# EAGLE schematic sensor_board2 (EAGLE 9.7.0)
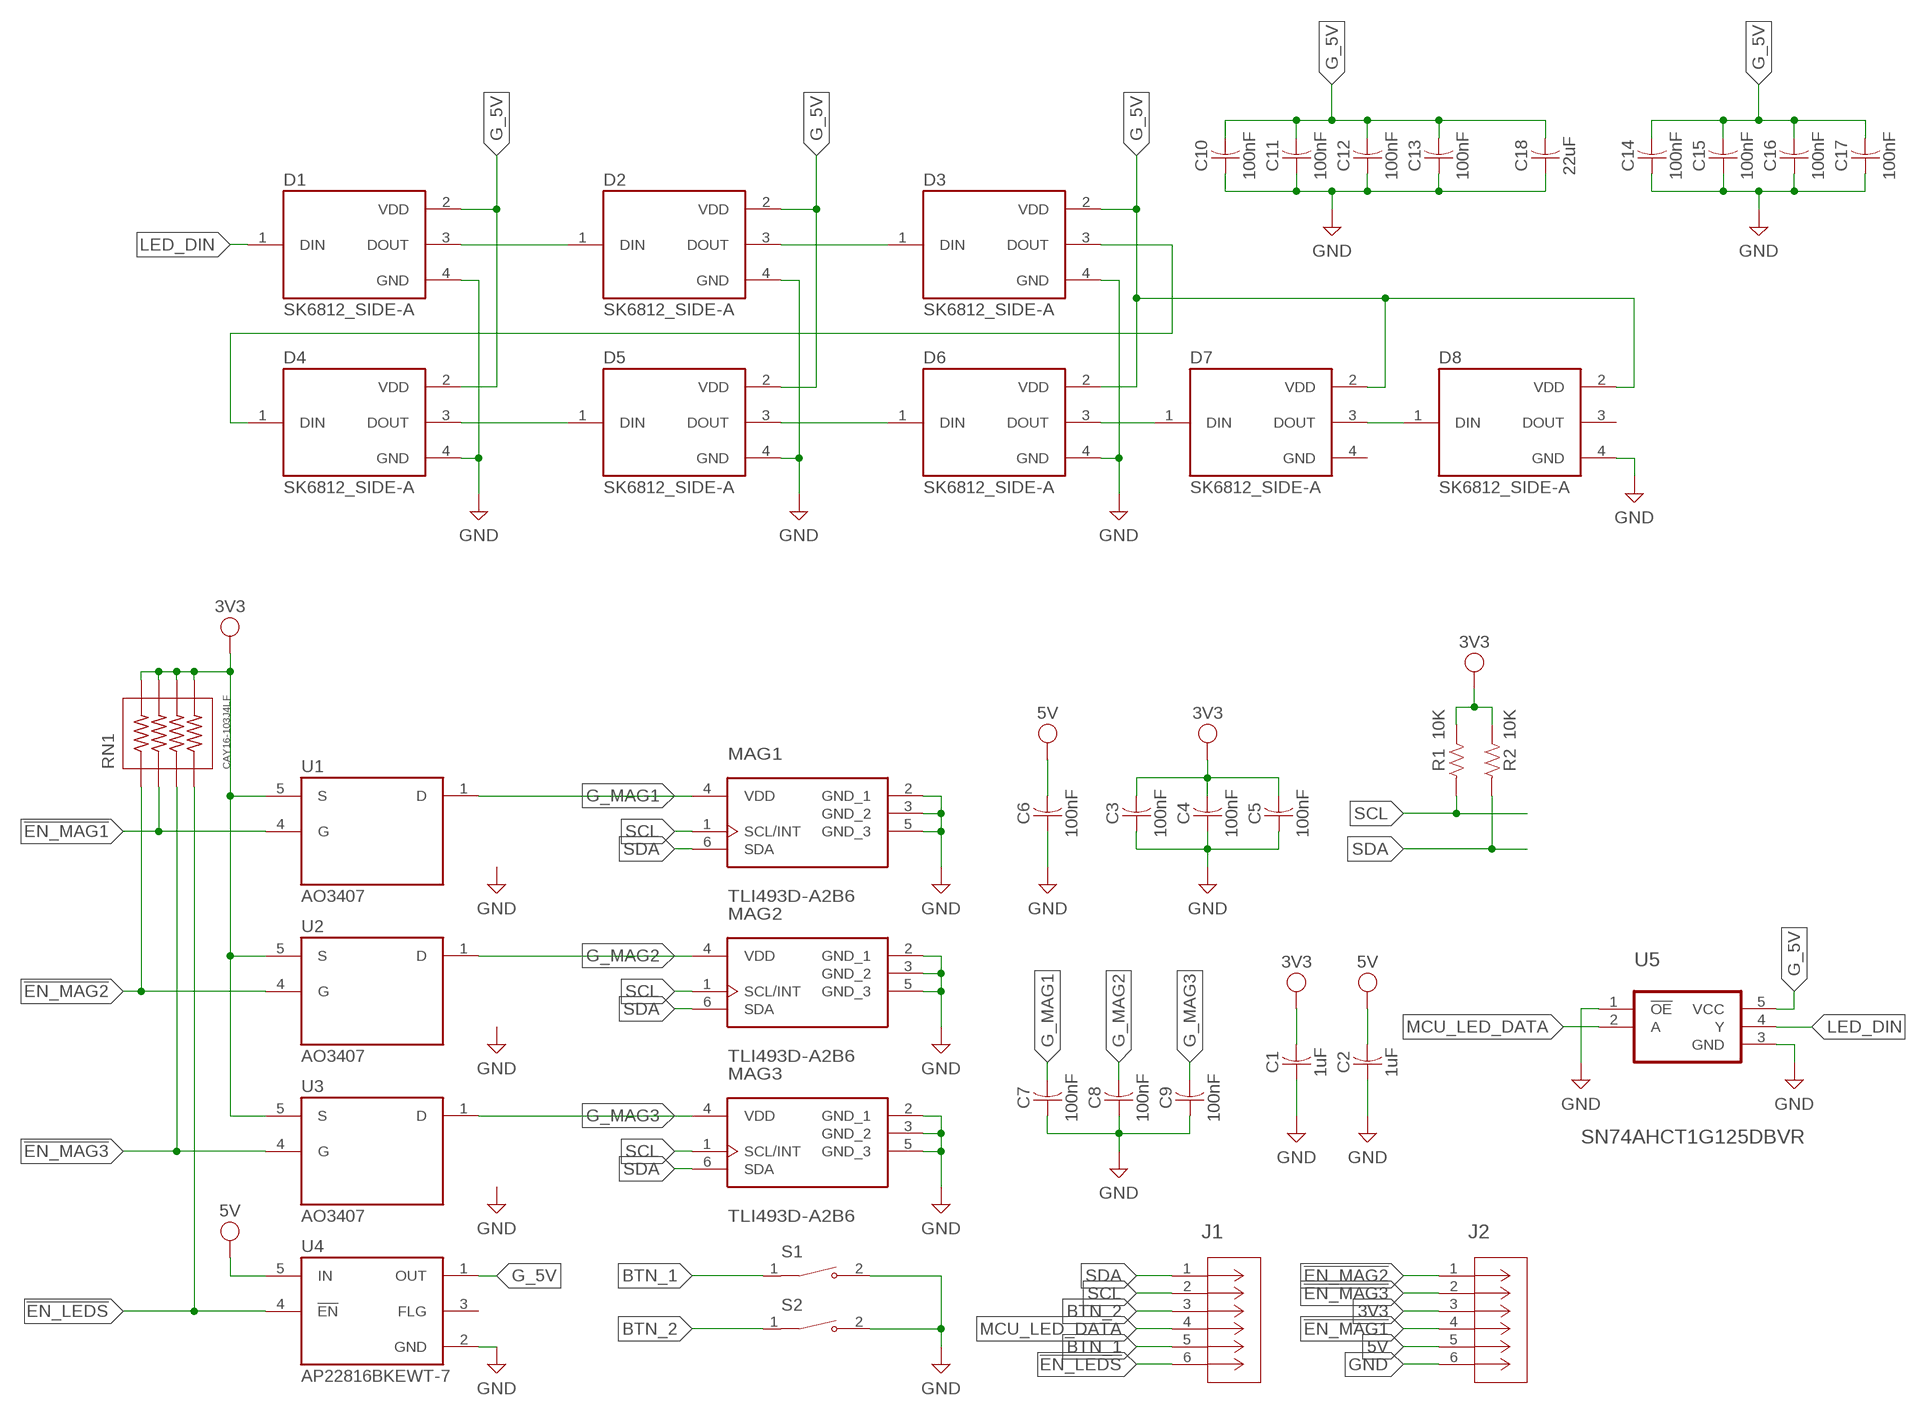
[diagram p0: schematic, sheet 1]

## Parts
C1  1uF  C-US_CHIP-1206(3216-METRIC)  [CAPC3216X135]
C2  1uF  C-US_CHIP-1206(3216-METRIC)  [CAPC3216X135]
C3  100nF  C-US_CHIP-0805(2012-METRIC)  [CAPC2012X110]
C4  100nF  C-US_CHIP-0805(2012-METRIC)  [CAPC2012X110]
C5  100nF  C-US_CHIP-0805(2012-METRIC)  [CAPC2012X110]
C6  100nF  C-US_CHIP-0805(2012-METRIC)  [CAPC2012X110]
C7  100nF  C-US_CHIP-0805(2012-METRIC)  [CAPC2012X110]
C8  100nF  C-US_CHIP-0805(2012-METRIC)  [CAPC2012X110]
C9  100nF  C-US_CHIP-0805(2012-METRIC)  [CAPC2012X110]
C10  100nF  C-US_CHIP-0805(2012-METRIC)  [CAPC2012X110]
C11  100nF  C-US_CHIP-0805(2012-METRIC)  [CAPC2012X110]
C12  100nF  C-US_CHIP-0805(2012-METRIC)  [CAPC2012X110]
C13  100nF  C-US_CHIP-0805(2012-METRIC)  [CAPC2012X110]
C14  100nF  C-US_CHIP-0805(2012-METRIC)  [CAPC2012X110]
C15  100nF  C-US_CHIP-0805(2012-METRIC)  [CAPC2012X110]
C16  100nF  C-US_CHIP-0805(2012-METRIC)  [CAPC2012X110]
C17  100nF  C-US_CHIP-0805(2012-METRIC)  [CAPC2012X110]
C18  22uF  C-US_CHIP-1206(3216-METRIC)  [CAPC3216X135]
D1  SK6812_SIDE-A  [LED_SK6812_SIDE-A]
D2  SK6812_SIDE-A  [LED_SK6812_SIDE-A]
D3  SK6812_SIDE-A  [LED_SK6812_SIDE-A]
D4  SK6812_SIDE-A  [LED_SK6812_SIDE-A]
D5  SK6812_SIDE-A  [LED_SK6812_SIDE-A]
D6  SK6812_SIDE-A  [LED_SK6812_SIDE-A]
D7  SK6812_SIDE-A  [LED_SK6812_SIDE-A]
D8  SK6812_SIDE-A  [LED_SK6812_SIDE-A]
J1  NPPN032AFCN-RCCONN3X2_NPPN032AFCN-RC_SUL  [CONN3X2_NPPN032AFCN-RC_SUL]
J2  NPPN032AFCN-RCCONN3X2_NPPN032AFCN-RC_SUL  [CONN3X2_NPPN032AFCN-RC_SUL]
MAG1  TLI493D-A2B6  [SOP95P280X110-6N-V]
MAG2  TLI493D-A2B6  [SOP95P280X110-6N-V]
MAG3  TLI493D-A2B6  [SOP95P280X110-6N-V]
R1  10K  R-US_CHIP-0805(2012-METRIC)  [RESC2012X65]
R2  10K  R-US_CHIP-0805(2012-METRIC)  [RESC2012X65]
RN1  CAY16-103J4LF  [RESCAF80P320X160X60-8N]
S1  TS32-7-35-BK-160-RA-SMT-TR  [SW_TS32-7-35-BK-160-RA-SMT-TR]
S2  TS32-7-35-BK-160-RA-SMT-TR  [SW_TS32-7-35-BK-160-RA-SMT-TR]
U1  AO3407  [SOT95P280X100-5N]
U2  AO3407  [SOT95P280X100-5N]
U3  AO3407  [SOT95P280X100-5N]
U4  AP22816BKEWT-7  [SOT95P280X100-5N]
U5  SN74AHCT1G125DBVR  [SOT95P280X145-5N]

## Nets
3V3: C1.2 C3.2 C4.2 C5.2 J2.3 R1.2 R2.2 RN1.5 RN1.6 RN1.7 RN1.8 U1.5(S) U2.5(S) U3.5(S)
5V: C2.2 C6.2 J2.5 U4.5(IN)
!EN_LEDS: J1.6 RN1.4 U4.4(!EN)
!EN_MAG1: J2.4 RN1.2 U1.4(G)
!EN_MAG2: J2.1 RN1.1 U2.4(G)
!EN_MAG3: J2.2 RN1.3 U3.4(G)
BTN_1: J1.5 S1.1
BTN_2: J1.3 S2.1
G_5V: C10.2 C11.2 C12.2 C13.2 C14.2 C15.2 C16.2 C17.2 C18.2 D1.2(VDD) D2.2(VDD) D3.2(VDD) D4.2(VDD) D5.2(VDD) D6.2(VDD) D7.2(VDD) D8.2(VDD) U4.1(OUT) U5.5(VCC)
G_MAG1: C7.2 MAG1.4(VDD) U1.1(D)
G_MAG2: C8.2 MAG2.4(VDD) U2.1(D)
G_MAG3: C9.2 MAG3.4(VDD) U3.1(D)
GND: C1.1 C2.1 C3.1 C4.1 C5.1 C6.1 C7.1 C8.1 C9.1 C10.1 C11.1 C12.1 C13.1 C14.1 C15.1 C16.1 C17.1 C18.1 D1.4(GND) D2.4(GND) D3.4(GND) D4.4(GND) D5.4(GND) D6.4(GND) D8.4(GND) J2.6 MAG1.2(GND_1) MAG1.3(GND_2) MAG1.5(GND_3) MAG2.2(GND_1) MAG2.3(GND_2) MAG2.5(GND_3) MAG3.2(GND_1) MAG3.3(GND_2) MAG3.5(GND_3) S1.2 S2.2 U4.2(GND) U5.1(!OE) U5.3(GND)
LED_DIN: D1.1(DIN) U5.4(Y)
MCU_LED_DATA: J1.4 U5.2(A)
N$1: D1.3(DOUT) D2.1(DIN)
N$2: D2.3(DOUT) D3.1(DIN)
N$3: D6.3(DOUT) D7.1(DIN)
N$4: D3.3(DOUT) D4.1(DIN)
N$5: D4.3(DOUT) D5.1(DIN)
N$6: D5.3(DOUT) D6.1(DIN)
N$7: D7.3(DOUT) D8.1(DIN)
SCL: J1.2 MAG1.1(SCL/INT) MAG2.1(SCL/INT) MAG3.1(SCL/INT) R1.1
SDA: J1.1 MAG1.6(SDA) MAG2.6(SDA) MAG3.6(SDA) R2.1
Unconnected: D8.3(DOUT) U4.3(FLG)

## Power pins joined to a net without a drawn wire
GND: D7.4(GND)

## Library data of the parts
C1 C2 C18 = Capacitor:C-US: Capacitor - ANSI; CATEGORY: Capacitor; PACKAGE_SIZE: 1206; PACKAGE_TYPE: Surface Mount; SUBCATEGORY: Ceramic Capacitors; TYPE: MLCC
C3-C17 = Capacitor:C-US: Capacitor - ANSI; CATEGORY: Capacitor; PACKAGE_SIZE: 0805; PACKAGE_TYPE: Surface Mount; SUBCATEGORY: Ceramic Capacitors; TYPE: MLCC
D1-D8 = SK6812_SIDE-A:SK6812_SIDE-A: Check availability <https://pricing.snapeda.com/parts/SK6812%20SIDE-A/Norman%20Electric/view-part?ref=eda>; AVAILABILITY: Not in stock; CHECK_PRICES: https://www.snapeda.com/parts/SK6812%20SIDE-A/Norman+Electric/view-part/?ref=eda; DESCRIPTION: INTEGRATED LIGHT SOURCE INTELLIGENT CONTROL OF CHIP-ON-TOP SMD TYPE LED; MF: Norman Electric; MP: SK6812 SIDE-A; PACKAGE: NON-STANDARD-4 Normand Electronics; PRICE: None; SNAPEDA_LINK: https://www.snapeda.com/parts/SK6812%20SIDE-A/Norman+Electric/view-part/?ref=snap
J1 J2 = NPPN032AFCN-RC:NPPN032AFCN-RC; COPYRIGHT: Copyright (C) 2026 Ultra Librarian. All rights reserved.; MANUFACTURER_NAME: Sullins; MANUFACTURER_PART_NUMBER: NPPN032AFCN-RC
MAG1-MAG3 = TLI493D-A2B6:TLI493D-A2B6: TLI493D-A2B6 SOP95P280X110-6N-V Low Power 3D Hall Sensor with I2C Interface and Wake Up Function
R1 R2 = Resistor:R-US: Resistor Fixed - ANSI; CATEGORY: Resistors; DESCRIPTION: Chip Resistor 2.00 X 1.25 X 0.65 mm body 0805(2012-METRIC) Package; PACKAGE_SIZE: 0805; PACKAGE_TYPE: Surface Mount
RN1 = CAY16-103J4LF:CAY16-103J4LF: Res Thick Film Array 75 Ohm 5% 0.25W(1/4W) ?200ppm/C ISOL Molded 8-Pin 1206(4 X 0603) Convex SMD T/R; CHECK_PRICES: https://www.snapeda.com/parts/CAY16-103J4LF/Bourns+-+J.W.+Miller/view-part/?ref=eda; DESCRIPTION: Resistor, Chip Array,10 Kilohms,62 mW,+ 5%,50 V (Max.) | Bourns CAY16-103J4LF; DIGIKEY_PART_NUMBER: CAY16-103J4LFTR-ND; MF: Bourns; MP: CAY16-103J4LF; PACKAGE: 1206 Bourns; PURCHASE-URL: https://www.snapeda.com/api/url_track_click_mouser/?unipart_id=47136&manufacturer=Bourns&part_name=CAY16-103J4LF&search_term=None; SNAPEDA_LINK: https://www.snapeda.com/parts/CAY16-103J4LF/Bourns+-+J.W.+Miller/view-part/?ref=snap
S1 S2 = TS32-7-35-BK-160-RA-SMT-TR:TS32-7-35-BK-160-RA-SMT-TR; MANUFACTURER: Same Sky; MAXIMUM_PACKAGE_HEIGHT: 3.7mm; PARTREV: 1.0; STANDARD: Manufacturer Recommendations
U1-U3 = AO3407:AO3407; DESCRIPTION: P-Channel MOSFET used as high-side switch for Hall sensor rails.; MF: AOS; MP: AO3407
U4 = AP22816BKEWT-7:AP22816BKEWT-7: Check availability <https://pricing.snapeda.com/parts/AP22816BKEWT-7/Diodes%20Zetex/view-part?ref=eda>; AVAILABILITY: In Stock; CHECK_PRICES: https://www.snapeda.com/parts/AP22816BKEWT-7/Diodes+Inc./view-part/?ref=eda; DESCRIPTION: Power Switch/Driver 1:1 N/P-Channel 1A TSOT-25; MF: Diodes Zetex; MP: AP22816BKEWT-7; PACKAGE: None; PRICE: None; SNAPEDA_LINK: https://www.snapeda.com/parts/AP22816BKEWT-7/Diodes+Inc./view-part/?ref=snap
U5 = SN74AHCT1G125DBVR:SN74AHCT1G125DBVR